# EAGLE design RollerControllerUSB (EAGLE 7.1.0)
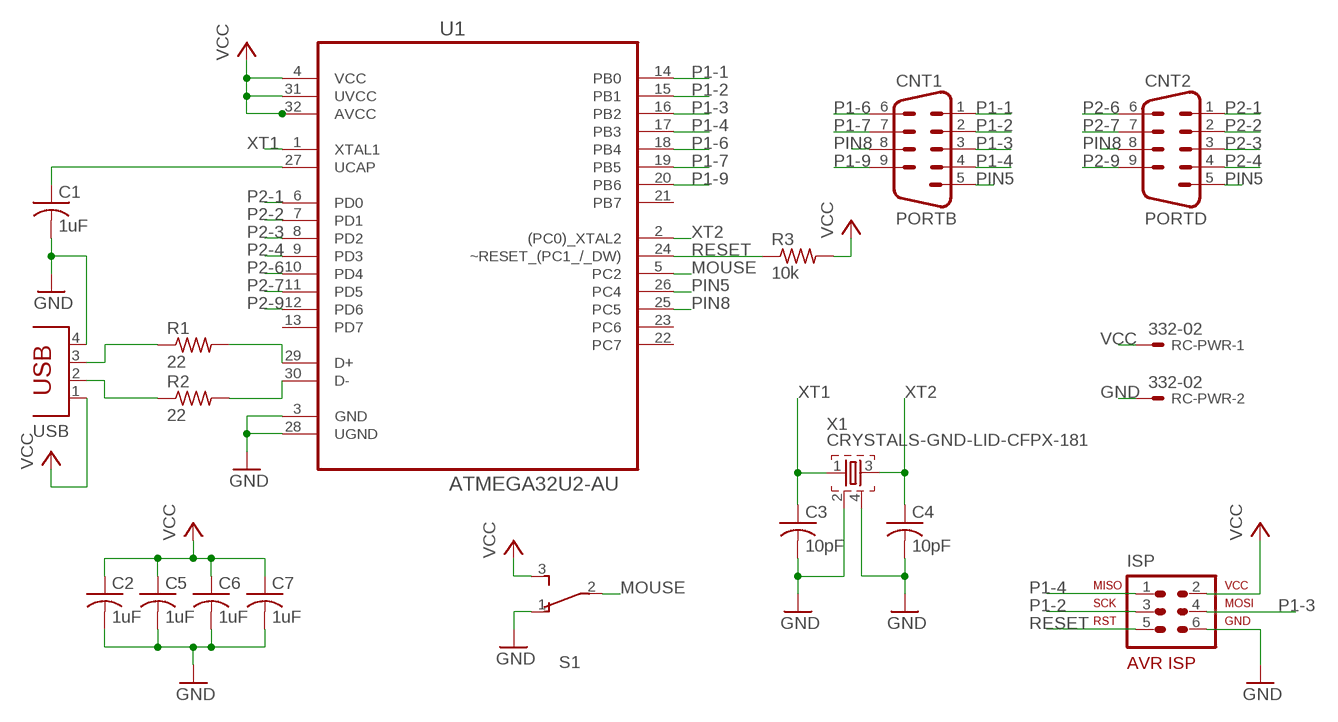
[diagram p0: schematic, sheet 1]

## Parts
C1  1uF  C-USC0603  [C0603]
C2  1uF  C-USC0603  [C0603]
C3  10pF  C-USC0603  [C0603]
C4  10pF  C-USC0603  [C0603]
C5  1uF  C-USC0603  [C0603]
C6  1uF  C-USC0603  [C0603]
C7  1uF  C-USC0603  [C0603]
CNT1  PORTB  M09HP  [M09HP]
CNT2  PORTD  M09HP  [M09HP]
ISP  AVR-ISP-6VERT  [AVR-ISP-6]
R1  22  R-US_R0603  [R0603]
R2  22  R-US_R0603  [R0603]
R3  10k  R-US_R0805  [R0805]
RC-PWR  332-02  [332-02]
S1  OS102011MA1QN1  [OS102011MA1QN1]
U1  ATMEGA32U2-AU  [QFP80P900X900X120-32N]
USB  PN61729  [PN61729]
X1  CRYSTALS-GND-LID-CFPX-181  [2.5X2-4-PAD]

## Nets
D_N: R2.2 U1.30(D-)
D_P: R1.2 U1.29(D+)
GND: C1.2 C2.2 C3.2 C4.2 C5.2 C6.2 C7.2 ISP.6 RC-PWR.2 S1.1(O) U1.3(GND) U1.28(UGND) USB.4 X1.2 X1.4
MOUSE: S1.2(P) U1.5(PC2)
N$5: C1.1 U1.27(UCAP)
P1-1: CNT1.1 U1.14(PB0)
P1-2: CNT1.2 ISP.3 U1.15(PB1)
P1-3: CNT1.3 ISP.4 U1.16(PB2)
P1-4: CNT1.4 ISP.1 U1.17(PB3)
P1-6: CNT1.6 U1.18(PB4)
P1-7: CNT1.7 U1.19(PB5)
P1-9: CNT1.9 U1.20(PB6)
P2-1: CNT2.1 U1.6(PD0)
P2-2: CNT2.2 U1.7(PD1)
P2-3: CNT2.3 U1.8(PD2)
P2-4: CNT2.4 U1.9(PD3)
P2-6: CNT2.6 U1.10(PD4)
P2-7: CNT2.7 U1.11(PD5)
P2-9: CNT2.9 U1.12(PD6)
PIN5: CNT1.5 CNT2.5 U1.26(PC4)
PIN8: CNT1.8 CNT2.8 U1.25(PC5)
RESET: ISP.5 R3.1 U1.24(~RESET_(PC1_/_DW))
USB_N: R2.1 USB.2
USB_P: R1.1 USB.3
VCC: C2.1 C5.1 C6.1 C7.1 ISP.2 R3.2 RC-PWR.1 S1.3(S) U1.4(VCC) U1.31(UVCC) U1.32(AVCC) USB.1
XT1: C3.1 U1.1(XTAL1) X1.1
XT2: C4.1 U1.2((PC0)_XTAL2) X1.3
Unconnected: U1.13(PD7) U1.21(PB7) U1.22(PC7) U1.23(PC6)

## Library data of the parts
C1-C7 = resistor:C-US: CAPACITOR, American symbol
CNT1 CNT2 = con-subd:M09: SUB-D; OC_FARNELL: unknown; OC_NEWARK: unknown
ISP = avr-7:AVR-ISP-6: AVR ISP-6 Serial Programming Header
R1-R3 = resistor:R-US_: RESISTOR, American symbol
RC-PWR = con-garry:332-02: 2 Pin - 2mm Dual Row Source: www.mpe-connector.de / garry_shortform_2012.pdf
S1 = nicks:OS102011MA1QN1: C&K Miniature Slide Switch SPDT, P/N: OS102011MA1QN1
U1 = Atmel_By_element14_Batch_1-00:ATMEGA32U2-AU: 8-bit Microcontroller with ISP Flash and USB Controller; MPN: ATMEGA32U2-AU; OC_FARNELL: 1748524; OC_NEWARK: 26R5632; PACKAGE: TQFP-32; SUPPLIER: Atmel
USB = con-berg:PN61729: BERG USB connector; OC_FARNELL: unknown; OC_NEWARK: unknown
X1 = IQD-Frequency-Products:CRYSTALS-GND-LID: CRYSTALS WITH CAN GROUNDED

## Board
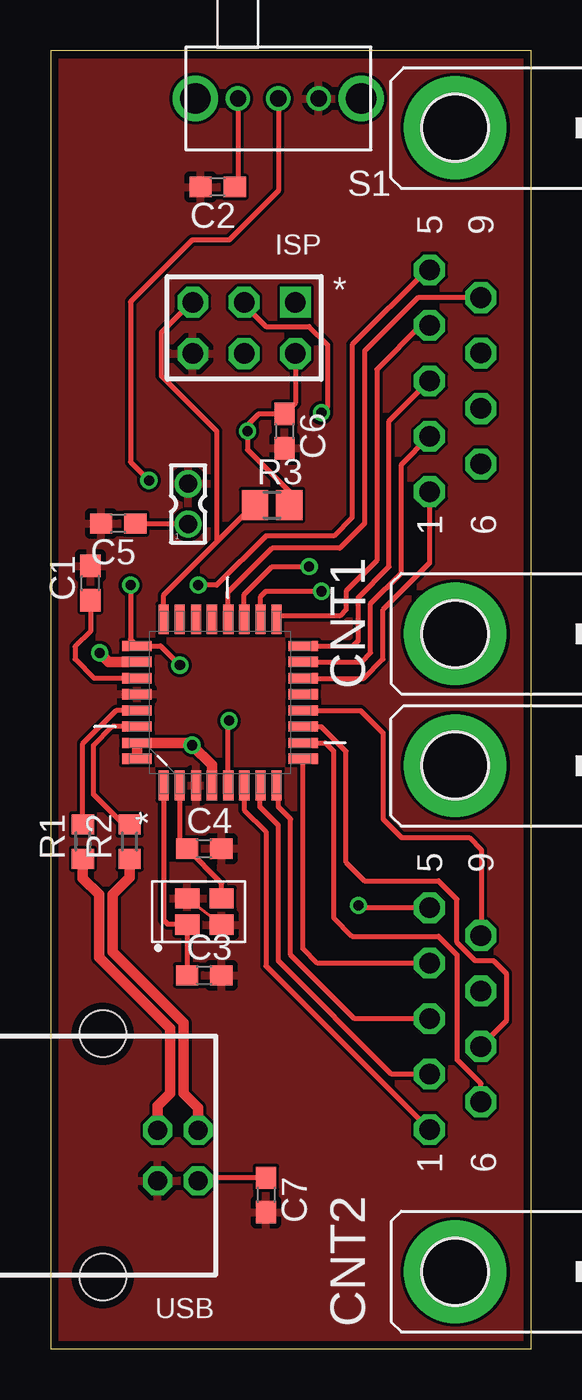
[diagram p1: board, top side]
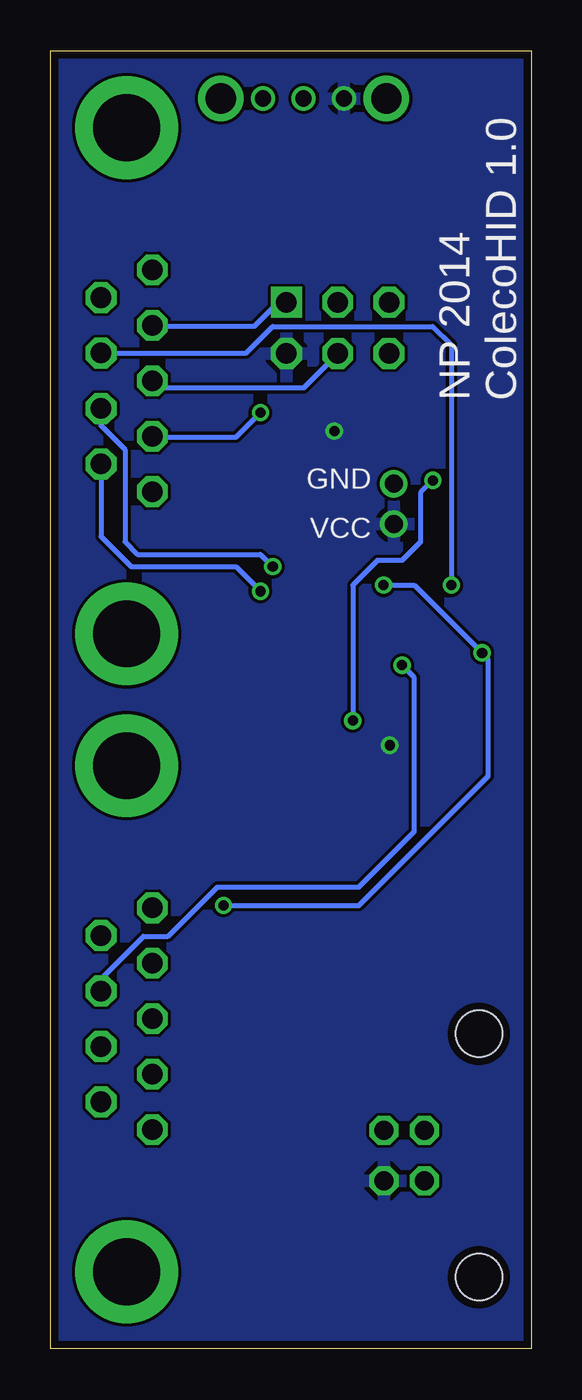
[diagram p2: board, bottom side, seen from below]

Size 23.8 x 64.25 mm. Coordinates in mm from the lower left corner, seen from the top.
Outline: 0,0 23.8,0 23.8,64.25 0,64.25 0,0
Copper layers (1*16): Top 0.0356mm / dielectric 1.5011mm / Bottom 0.0356mm
Design rules "oshpark-2layer": minimum track width 6mil, minimum drill 13mil, track to track 6mil, track to pad 6mil, pad to pad 6mil, via to via 6mil, smd to smd 6mil, copper to edge 15mil, drill to drill 6mil, minimum pad ring 7mil, minimum via ring 7mil, stop-mask expansion 4mil, vias tented up to drill 0mil, thermal gap 10mil

### Footprints (pad centres in the part's own frame; a part is rotated, then mirrored left to right if it is on the bottom)
C0603 = smd 1.1 x 1: 1 -0.85,0; 2 0.85,0
M09HP = drill 1.016 octagon: 1 -5.486,1.27; 2 -2.743,1.27; 3 0,1.27; 4 2.743,1.27; 5 5.486,1.27; 6 -4.115,-1.27; 7 -1.372,-1.27; 8 1.372,-1.27; 9 4.115,-1.27 | drill 3.302 pad 5.08: G1 -12.522,0; G2 12.522,0
AVR-ISP-6 = drill 1.016 square: 1 -2.54,-1.27 | drill 1.016 octagon: 2 -2.54,1.27; 3 0,-1.27; 4 0,1.27; 5 2.54,-1.27; 6 2.54,1.27
R0603 = smd 1 x 1.1: 1 -0.85,0; 2 0.85,0
R0805 = smd 1.3 x 1.5: 1 -0.85,0; 2 0.85,0
332-02 = drill 0.9 pad 1.27: 1 0,-1; 2 0,1
OS102011MA1QN1 = drill 0.8: 1 -2,0; 2 0,0; 3 2,0 | drill 1.5: NC1 -4.1,0; NC2 4.1,0
QFP80P900X900X120-32N = smd 1.473 x 0.508: 1 -4.115,2.794; 2 -4.115,2.007; 3 -4.115,1.194; 4 -4.115,0.406; 5 -4.115,-0.406; 6 -4.115,-1.194; 7 -4.115,-2.007; 8 -4.115,-2.794; 17 4.115,-2.794; 18 4.115,-2.007; 19 4.115,-1.194; 20 4.115,-0.406; 21 4.115,0.406; 22 4.115,1.194; 23 4.115,2.007; 24 4.115,2.794 | smd 0.508 x 1.473: 9 -2.794,-4.115; 10 -2.007,-4.115; 11 -1.194,-4.115; 12 -0.406,-4.115; 13 0.406,-4.115; 14 1.194,-4.115; 15 2.007,-4.115; 16 2.794,-4.115; 25 2.794,4.115; 26 2.007,4.115; 27 1.194,4.115; 28 0.406,4.115; 29 -0.406,4.115; 30 -1.194,4.115; 31 -2.007,4.115; 32 -2.794,4.115
PN61729 = drill 0.95 octagon: 1 1.25,4.71; 2 -1.25,4.71; 3 -1.25,2.71; 4 1.25,2.71 | hole 2.3: -6.02,0; 6.02,0
2.5X2-4-PAD = smd 1.2 x 1: 1 -0.85,-0.65; 2 0.85,-0.65; 3 0.85,0.65; 4 -0.85,0.65

### Placement (x,y rotation side)
C1  1.98,37.9 90 top
C2  8.28,57.49 180 top
C3  7.61,18.49 0 top
C4  7.61,24.75 0 top
C5  3.35,40.84 180 top
C6  11.58,45.42 270 top
C7  10.67,7.62 270 top
CNT1  20.03,47.9 90 top
CNT2  20.03,16.34 90 top
ISP  9.58,50.52 180 top
R1  1.6,25.1 90 top
R2  3.91,25.1 90 top
R3  10.97,41.76 0 top
RC-PWR  6.81,41.81 0 top
S1  11.28,61.87 180 top
U1  8.4,31.99 90 top
USB  2.59,9.57 270 top
X1  7.62,21.64 0 top

### Tracks (layer width: path | path; a pad name or v marks a point on that pad's centre or on a via)
D_N
  Top 0.254: R2.2 3.61,25.95 2.13,27.43 2.13,29.87 3.06,30.8 U1.30
D_P
  Top 0.254: U1.29 3.24,31.59 1.6,29.95 R1.2
GND
  Top 0.152: X1.4 X1.2
  pour Top: -11.75,69.6 -12.67,-7.79 58.72,-6.88 59.03,68.68
MOUSE  (via drill 0.5)
  Top 0.254: S1.2 11.28,57.3 8.84,54.86 7.01,54.86 3.96,51.82 3.96,43.89 v4.88,42.98 | U1.5 8.8,31.05 v8.84,31.09
  Bottom 0.254: v4.88,42.98 5.49,42.37 5.49,39.93 6.4,39.01 7.62,39.01 8.84,37.8 v8.84,31.09
N$5
  Top 0.254: C1.1 1.98,35.51 1.22,34.75 1.22,34.14 2.17,33.19 U1.27
P1-1
  Top 0.254: CNT1.1 18.76,38.88 16.46,36.58 16.46,34.14 15.51,33.19 U1.14
P1-2  (via drill 0.5)
  Top 0.254: U1.15 15.41,34 15.85,34.44 15.85,36.88 17.37,38.41 17.37,43.77 CNT1.2 | ISP.3 9.59,51.68 10.67,50.6 12.8,50.6 13.72,49.68 13.72,46.63 v13.41,46.33
  Bottom 0.254: CNT1.2 18.71,45.11 14.63,45.11 v13.41,46.33
P1-3
  Top 0.254: U1.16 14.97,34.79 15.24,35.05 15.24,37.19 16.76,38.71 16.76,45.9 CNT1.3
  Bottom 0.254: ISP.4 11.28,47.55 18.41,47.55 CNT1.3
P1-4
  Top 0.254: U1.17 11.35,36.27 14.33,36.27 14.63,36.58 14.63,37.49 16.15,39.01 16.15,48.46 18.34,50.65 CNT1.4
  Bottom 0.254: ISP.1 12.52,51.79 13.72,50.6 18.71,50.6 CNT1.4
P1-6  (via drill 0.5)
  Top 0.254: U1.18 10.4,37.22 10.67,37.49 v13.41,37.49
  Bottom 0.254: CNT1.6 21.3,40.2 19.81,38.71 14.63,38.71 v13.41,37.49
P1-7  (via drill 0.5)
  Top 0.254: U1.19 9.59,37.33 10.97,38.71 v12.8,38.71
  Bottom 0.254: CNT1.7 21.3,45.69 20.12,44.5 20.12,39.93 19.51,39.32 13.41,39.32 v12.8,38.71
P1-9
  Top 0.254: CNT1.9 18.19,52.02 15.54,49.38 15.54,40.84 14.33,39.62 10.97,39.62 8.8,37.45 U1.20
P2-1
  Top 0.254: U1.6 9.59,26.68 10.67,25.6 10.67,18.95 CNT2.1
P2-2
  Top 0.254: CNT2.2 16.88,13.6 11.28,19.2 11.28,25.91 10.36,26.82 10.36,27.84 U1.7
P2-3
  Top 0.254: CNT2.3 15.05,16.34 11.89,19.51 11.89,26.21 11.28,26.82 11.28,27.79 U1.8
P2-4
  Top 0.254: CNT2.4 13.22,19.09 12.5,19.81 12.5,29.19 U1.9
P2-6
  Top 0.254: CNT2.6 21.3,13.14 20.12,14.33 20.12,19.51 19.2,20.42 14.94,20.42 14.02,21.34 14.02,29.57 13.6,29.99 U1.10
P2-7
  Top 0.254: U1.11 13.4,30.8 14.63,29.57 14.63,24.08 15.54,23.16 19.2,23.16 20.12,22.25 20.12,20.12 21.03,19.2 21.95,19.2 22.55,18.59 22.55,16.22 CNT2.7
P2-9
  Top 0.254: U1.12 15.35,31.59 16.46,30.48 16.46,26.21 17.37,25.3 20.73,25.3 21.34,24.69 21.34,20.49 CNT2.9
PIN5  (via drill 0.5)
  Top 0.254: CNT2.5 15.36,21.83 v15.24,21.95 | CNT1.5 18.64,53.39 14.94,49.68 14.94,41.15 14.02,40.23 10.67,40.23 8.23,37.8 v7.32,37.8
  Top 0.508: U1.26 2.88,34 v2.44,34.44
  Bottom 0.254: v15.24,21.95 8.53,21.95 2.13,28.35 2.13,34.14 v2.44,34.44 5.79,37.8 v7.32,37.8
PIN8  (via drill 0.5)
  Top 0.254: v6.4,33.83 5.45,34.79 U1.25 3.96,35.1 v3.96,37.8
  Bottom 0.254: CNT2.8 21.3,18.32 19.2,20.42 17.98,20.42 15.54,22.86 8.53,22.86 5.79,25.6 5.79,33.22 v6.4,33.83 | CNT1.8 14.12,49.28 12.8,50.6 4.88,50.6 3.96,49.68 v3.96,37.8
RESET
  Top 0.254: ISP.5 6.99,51.79 5.49,50.29 5.49,48.16 8.23,45.41 8.23,39.93 | U1.24 5.6,37.3 8.23,39.93 | R3.1 10.06,41.76 8.23,39.93
USB_N
  Top 0.508: USB.2 7.3,11.93 6.58,12.65 6.58,16.14 3.07,19.64 3.07,22.48 3.92,23.32 R2.1
USB_P
  Top 0.508: USB.3 5.3,12.03 5.92,12.65 5.92,15.87 2.41,19.37 2.41,22.48 1.6,23.29 R1.1
VCC  (via drill 0.5)
  Top 0.254: RC-PWR.1 4.23,40.81 C5.1 | S1.3 9.28,57.64 | R3.2 11.82,42.43 9.75,44.5 v9.75,45.41 9.75,45.72 10.3,46.27 C6.1 12.12,46.81 ISP.2 | C7.1 7.45,8.47 USB.1
  Top 0.508: U1.32 U1.31 6.89,29.99 v7.01,29.87 7.99,28.89 U1.4 | 9.28,57.64 C2.1
  pour Bottom: -10.53,67.77 -10.23,-5.05 56.89,-5.05 57.2,67.47
XT1
  Top 0.254: U1.1 5.6,21.22 5.79,21.03 6.73,21.03 X1.1 6.77,18.5
  Top 0.508: 6.77,18.5 C3.1
XT2
  Top 0.254: U1.2 6.39,25.12 C4.1 8.47,23.04 X1.3

### Text on the board
tPlace: ISP | USB
bPlace: NP 2014 / ColecoHID 1.0 | GND | VCC